# Altium schematic sheet Sheet1.SchDoc
size A3
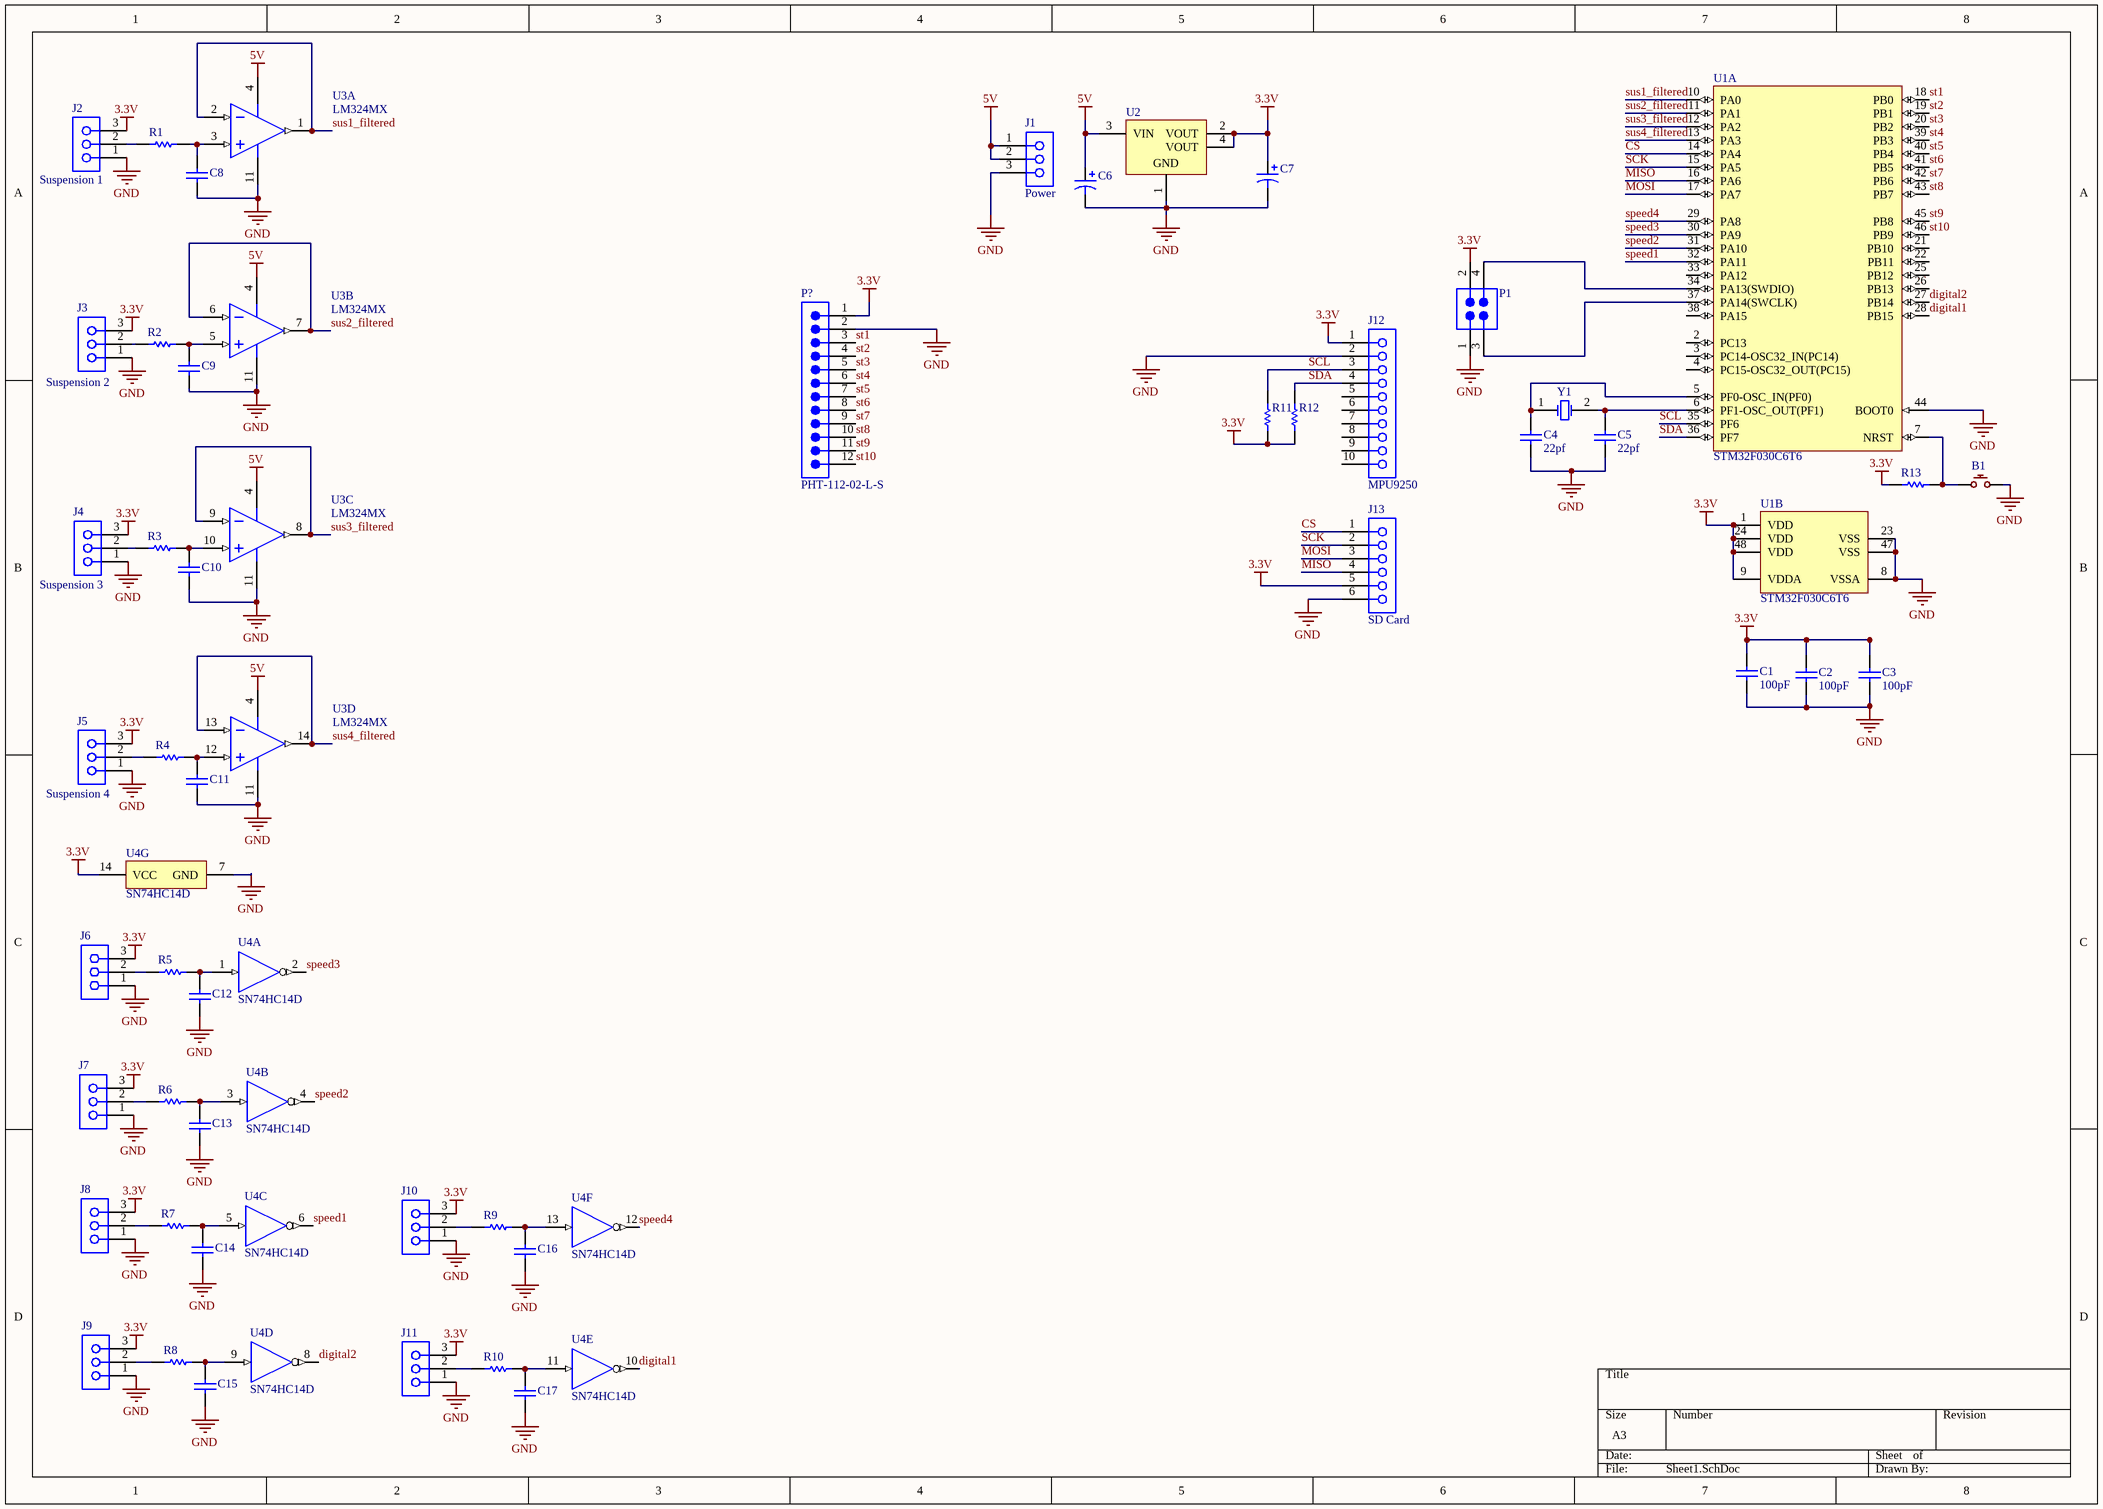
[diagram p0: Sheet1.SchDoc]

## Parts
B1  Reset Button  [SMD Mini Push Button Switch 4 Pin]  (value not drawn)
C1  value 100pF  [1206]  (hidden comment: C1206)
C2  value 100pF  [1206]  (hidden comment: C1206)
C3  value 100pF  [1206]  (hidden comment: C1206)
C4  value 22pf  [1206]  (hidden comment: C1206)
C5  value 22pf  [1206]  (hidden comment: C1206)
C6  EKA00AA210L00  [CAPPR2-5X11]  (value not drawn)
C7  EKA00DD222S00  [CAPPR5-10X16]  (value not drawn)
C8  C1206  [1206]  (value not drawn)
C9  C1206  [1206]  (value not drawn)
C10  C1206  [1206]  (value not drawn)
C11  C1206  [1206]  (value not drawn)
C12  C1206  [1206]  (value not drawn)
C13  C1206  [1206]  (value not drawn)
C14  C1206  [1206]  (value not drawn)
C15  C1206  [1206]  (value not drawn)
C16  C1206  [1206]  (value not drawn)
C17  C1206  [1206]  (value not drawn)
J1  Power  [SMTC-BCS-103-X-S-TE]
J2  Suspension 1  [SMTC-BCS-103-X-S-TE]
J3  Suspension 2  [SMTC-BCS-103-X-S-TE]
J4  Suspension 3  [SMTC-BCS-103-X-S-TE]
J5  Suspension 4  [SMTC-BCS-103-X-S-TE]
J6  BCS-103-L-S-TE  [SMTC-BCS-103-X-S-TE]  (value not drawn)
J7  BCS-103-L-S-TE  [SMTC-BCS-103-X-S-TE]  (value not drawn)
J8  BCS-103-L-S-TE  [SMTC-BCS-103-X-S-TE]  (value not drawn)
J9  BCS-103-L-S-TE  [SMTC-BCS-103-X-S-TE]  (value not drawn)
J10  BCS-103-L-S-TE  [SMTC-BCS-103-X-S-TE]  (value not drawn)
J11  BCS-103-L-S-TE  [SMTC-BCS-103-X-S-TE]  (value not drawn)
J12  MPU9250  [SMTC-SSW-110-03-X-S]
J13  SD Card  [SMTC-SSW-106-02-X-S]
P1  HW-02-12-T-D-750-100  [SMTC-HW-02-12-X-D-750-100]  (value not drawn)
P?  PHT-112-02-L-S  [SMTC-PHT-112-02-X-S]
R1  ERJ8GE  [8-1206]  (value not drawn)
R2  ERJ8GE  [8-1206]  (value not drawn)
R3  ERJ8GE  [8-1206]  (value not drawn)
R4  ERJ8GE  [8-1206]  (value not drawn)
R5  ERJ8GE  [8-1206]  (value not drawn)
R6  ERJ8GE  [8-1206]  (value not drawn)
R7  ERJ8GE  [8-1206]  (value not drawn)
R8  ERJ8GE  [8-1206]  (value not drawn)
R9  ERJ8GE  [8-1206]  (value not drawn)
R10  ERJ8GE  [8-1206]  (value not drawn)
R11  ERJ8GE  [8-1206]  (value not drawn)
R12  ERJ8GE  [8-1206]  (value not drawn)
R13  ERJ8GE  [8-1206]  (value not drawn)
U1  STM32F030C6T6  [STM-LQFP48_N]  (parts A,B of 2)
U2  LD1117AS33TR  [SOT-223_N]  (value not drawn)
U3  LM324MX  [M14A_N]  (parts A,B,C,D of 4)
U4  SN74HC14D  [D0014A_N]  (parts A,B,C,D,E,F,G of 7)
Y1  ECS-10-13-1  [HC-49U]  (value not drawn)

## Nets
3.3V: C1.2 C2.2 C3.2 C7.1 J2.3 J3.3 J4.3 J5.3 J6.3 J7.3 J8.3 J9.3 J10.3 J11.3 J12.1 J13.5 P1.2 P?.1 R11.1 R12.1 R13.1 U1.1(VDD) U1.9(VDDA) U1.24(VDD) U1.48(VDD) U2.2(VOUT) U2.4(VOUT) U4.14(VCC)
5V: C6.1 J1.1 J1.2 U2.3(VIN) U3.4(V+)
GND: B1.2 C1.1 C2.1 C3.1 C4.1 C5.1 C6.2 C7.2 C8.1 C9.1 C10.1 C11.1 C12.1 C13.1 C14.1 C15.1 C16.1 C17.1 J1.3 J2.1 J3.1 J4.1 J5.1 J6.1 J7.1 J8.1 J9.1 J10.1 J11.1 J12.2 J13.6 P1.1 P?.2 U1.8(VSSA) U1.23(VSS) U1.44(BOOT0) U1.47(VSS) U2.1(GND) U3.11(GND) U4.7(GND)
CS: J13.1 U1.14(PA4)
digital1: U1.28(PB15) U4.10(~{5Y})
digital2: U1.27(PB14) U4.8(~{4Y})
MISO: J13.4 U1.16(PA6)
MOSI: J13.3 U1.17(PA7)
SCK: J13.2 U1.15(PA5)
SCL: J12.3 R11.2 U1.35(PF6)
SDA: J12.4 R12.2 U1.36(PF7)
speed1: U1.32(PA11) U4.6(~{3Y})
speed2: U1.31(PA10) U4.4(~{2Y})
speed3: U1.30(PA9) U4.2(~{1Y})
speed4: U1.29(PA8) U4.12(~{6Y})
st1: P?.3 U1.18(PB0)
st2: P?.4 U1.19(PB1)
st3: P?.5 U1.20(PB2)
st4: P?.6 U1.39(PB3)
st5: P?.7 U1.40(PB4)
st6: P?.8 U1.41(PB5)
st7: P?.9 U1.42(PB6)
st8: P?.10 U1.43(PB7)
st9: P?.11 U1.45(PB8)
st10: P?.12 U1.46(PB9)
sus1_filtered: U1.10(PA0) U3.1(OUT1) U3.2(IN1-)
sus2_filtered: U1.11(PA1) U3.6(IN2-) U3.7(OUT2)
sus3_filtered: U1.12(PA2) U3.8(OUT3) U3.9(IN3-)
sus4_filtered: U1.13(PA3) U3.13(IN4-) U3.14(OUT4)
NetB1_1: B1.1 R13.2 U1.7(NRST)
NetC4_2: C4.2 U1.5(PF0-OSC_IN(PF0)) Y1.1(OSC1)
NetC5_2: C5.2 U1.6(PF1-OSC_OUT(PF1)) Y1.2(OSC2)
NetC8_2: C8.2 R1.2 U3.3(IN1+)
NetC9_2: C9.2 R2.2 U3.5(IN2+)
NetC10_2: C10.2 R3.2 U3.10(IN3+)
NetC11_2: C11.2 R4.2 U3.12(IN4+)
NetC12_2: C12.2 R5.2 U4.1(1A)
NetC13_2: C13.2 R6.2 U4.3(2A)
NetC14_2: C14.2 R7.2 U4.5(3A)
NetC15_2: C15.2 R8.2 U4.9(4A)
NetC16_2: C16.2 R9.2 U4.13(6A)
NetC17_2: C17.2 R10.2 U4.11(5A)
NetJ2_2: J2.2 R1.1
NetJ3_2: J3.2 R2.1
NetJ4_2: J4.2 R3.1
NetJ5_2: J5.2 R4.1
NetJ6_2: J6.2 R5.1
NetJ7_2: J7.2 R6.1
NetJ8_2: J8.2 R7.1
NetJ9_2: J9.2 R8.1
NetJ10_2: J10.2 R9.1
NetJ11_2: J11.2 R10.1
NetP1_3: P1.3 U1.37(PA14(SWCLK))
NetP1_4: P1.4 U1.34(PA13(SWDIO))

Not connected (* = marked no-connect by the designer): J12 5 6 7 8 9 10; U1 2(PC13) 3(PC14-OSC32_IN(PC14)) 4(PC15-OSC32_OUT(PC15)) 21(PB10) 22(PB11) 25(PB12) 26(PB13) 33(PA12) 38(PA15)

## Library data of the parts
B1 = SMD Mini Push Button Switch 4 Pin
C1-C5 = C1206: Ceramic Chip Capacitor - Standard; Published: 17-Jul-2002; LatestRevisionDate: 19-Mar-2004; LatestRevisionNote: Silkscreen size reduced.; DatasheetDocument: Mar-2001; PackageDocument: Mar-2001; PackageReference: 1206; Publisher: Altium Limited; Code_JEITA: 1206; Code_IPC: 3216 [1206]; ComponentLink1Description: Manufacturer Link; ComponentLink1URL: http://www.kemet.com/; ComponentLink2Description: Datasheet; ComponentLink2URL: http://www.kemet.com/kemet/web/homepage/kechome.nsf/vapubfilesname/F3102TA.pdf/$file/F3102TA.pdf
C6 = EKA00AA210L00: Aluminum Electrolytic Capacitor, Radial Style with Long Leads: 10uF, 100V; Note: Refer to Manufacturer's Data Sheets for other lead formations; DrillSize: Nominal, Rounded To The Nearest 0.1mm; Published: 19-Mar-2004; DatasheetDocument: 20-Feb-2001; PackageReference: CAPPR2-5X11; Publisher: Altium Limited; ComponentLink1Description: Manufacturer Link; ComponentLink1URL: http://www.vishay.com/; ComponentLink2Description: Datasheet; ComponentLink2URL: http://www.vishay.com/docs/25014/eka.pdf; Value: 10uF
C7 = EKA00DD222S00: Aluminum Electrolytic Capacitor, Radial Style with Long Leads: 22uF, 200V; Note: Refer to Manufacturer's Data Sheets for other lead formations; DrillSize: Nominal, Rounded To The Nearest 0.1mm; Published: 19-Mar-2004; DatasheetDocument: 20-Feb-2001; PackageReference: CAPPR5-10X16; Publisher: Altium Limited; ComponentLink1Description: Manufacturer Link; ComponentLink1URL: http://www.vishay.com/; ComponentLink2Description: Datasheet; ComponentLink2URL: http://www.vishay.com/docs/25014/eka.pdf; Value: 22uF
C8-C17 = C1206: Ceramic Chip Capacitor - Standard; Value: 100pF; Published: 17-Jul-2002; LatestRevisionDate: 19-Mar-2004; LatestRevisionNote: Silkscreen size reduced.; DatasheetDocument: Mar-2001; PackageDocument: Mar-2001; PackageReference: 1206; Publisher: Altium Limited; Code_JEITA: 1206; Code_IPC: 3216 [1206]; ComponentLink1Description: Manufacturer Link; ComponentLink1URL: http://www.kemet.com/; ComponentLink2Description: Datasheet; ComponentLink2URL: http://www.kemet.com/kemet/web/homepage/kechome.nsf/vapubfilesname/F3102TA.pdf/$file/F3102TA.pdf
J1 = BCS-103-F-S-TE: Tiger Claw(TM) Pass-Through Socket, Vertical, -55 to 125 degC, 2.54 mm Pitch, 3-Pin, Female, RoHS; Manufacturer: Samtec; Pitch: 2.54 mm; DatasheetVersion: F-214; PackageVersion: BV, 9/1991; PackageReference: BCS-103-X-S-TE; PackageDescription: Box Connector Socket Strip; Orientation: Vertical; RoHS: True; Temperature Range: -55 to 125 degC; Mounting Technology: Through-hole; PartNumber: BCS-103-F-S-TE; ComponentLink1Description: Manufacturer URL; ComponentLink1URL: http://www.samtec.com; ComponentLink2Description: Datasheet; ComponentLink2URL: http://www.samtec.com/documents/webfiles/pdf/BCS.PDF; ComponentLink3Description: Package Specification; ComponentLink3URL: http://www.samtec.com/documents/webfiles/cpdf/BCS-1XX-XXX-X-XX-XXX-MKT.pdf
J2-J11 = BCS-103-L-S-TE: Tiger Claw(TM) Pass-Through Socket, Vertical, -55 to 125 degC, 2.54 mm Pitch, 3-Pin, Female, RoHS; Manufacturer: Samtec; Pitch: 2.54 mm; DatasheetVersion: F-214; PackageVersion: BV, 9/1991; PackageReference: BCS-103-X-S-TE; PackageDescription: Box Connector Socket Strip; Supplier 1: Digi-Key; Supplier Part Number 1: SAM1011-03-ND; Supplier 2: Newark; Supplier Part Number 2: 11P3213; Orientation: Vertical; RoHS: True; Temperature Range: -55 to 125 degC; Mounting Technology: Through-hole; PartNumber: BCS-103-L-S-TE; ComponentLink1Description: Manufacturer URL; ComponentLink1URL: http://www.samtec.com; ComponentLink2Description: Datasheet; ComponentLink2URL: http://www.samtec.com/documents/webfiles/pdf/BCS.PDF; ComponentLink3Description: Package Specification; ComponentLink3URL: http://www.samtec.com/documents/webfiles/cpdf/BCS-1XX-XXX-X-XX-XXX-MKT.pdf
J12 = SSW-110-03-T-S: SQ Post Socket, Through-hole, Vertical, -55 to 105 degC, 2.54 mm Pitch, 10-Pin, Female, RoHS; Manufacturer: Samtec; Pitch: 2.54 mm; DatasheetVersion: F-214; PackageVersion: CA, 6/1987; PackageReference: SSW-110-03-X-S; PackageDescription: Assembly, Socket Strip .016 X .031 Tail; Orientation: Vertical; RoHS: True; Temperature Range: -55 to 105 degC; Mounting Technology: Through-hole; PartNumber: SSW-110-03-T-S; ComponentLink1Description: Manufacturer URL; ComponentLink1URL: http://www.samtec.com; ComponentLink2Description: Datasheet; ComponentLink2URL: http://www.samtec.com/documents/webfiles/pdf/SSW_TH.PDF; ComponentLink3Description: Package Specification; ComponentLink3URL: http://www.samtec.com/documents/webfiles/cpdf/SSW-1XX-XX-XXX-X-XX-XXX-XX-MKT.pdf
J13 = SSW-106-02-T-S: SQ Post Socket, Through-hole, Vertical, -55 to 105 degC, 2.54mm Pitch, 6-Pin, Female, RoHS; Manufacturer: Samtec; DatasheetVersion: F-214; PackageVersion: CA, 6/1987; PackageReference: SSW-106-02-X-S; PackageDescription: Assembly, Socket Strip .016 X .031 Tail; Supplier 1: Digi-Key; Supplier Part Number 1: SAM1222-06-ND; Supplier 2: Newark; Supplier Part Number 2: 11P9419; Orientation: Vertical; Pitch: 2.54 mm; RoHS: True; Temperature Range: -55 to 105 degC; Mounting Technology: Through-hole; PartNumber: SSW-106-02-T-S; ComponentLink1Description: Manufacturer URL; ComponentLink1URL: http://www.samtec.com; ComponentLink2Description: Datasheet; ComponentLink2URL: http://www.samtec.com/documents/webfiles/pdf/SSW_TH.PDF; ComponentLink3Description: Package Specification; ComponentLink3URL: http://www.samtec.com/documents/webfiles/cpdf/SSW-1XX-XX-XXX-X-XX-XXX-XX-MKT.pdf
P1 = HW-02-12-T-D-750-100: Flexible .025" SQ Board Stacker, Through-hole, Vertical, -55 to 105 degC, 2.54 mm Pitch, 4-Pin, Male, RoHS; Manufacturer: Samtec; Pitch: 2.54 mm; DatasheetVersion: F-214; PackageVersion: Y, 8/1991; PackageReference: HW-02-12-X-D-750-100; PackageDescription: .100[2.54] High Temp Terminal Body (Board Stacking); Orientation: Vertical; RoHS: True; Temperature Range: -55 to 105 degC; Mounting Technology: Through-hole; PartNumber: HW-02-12-T-D-750-100; ComponentLink1Description: Datasheet; ComponentLink1URL: http://www.samtec.com/documents/webfiles/pdf/HW_TH.PDF; ComponentLink2Description: Package Specification; ComponentLink2URL: http://www.samtec.com/documents/webfiles/cpdf/HW-XX-XX-XX-X-XXX-XXX-XX-XXX-MKT.pdf
P? = PHT-112-02-L-S: Press Fit Header, Through-hole, Vertical, -55 to 125 degC, 2.54 mm Pitch, 12-Pin, Male, RoHS; Manufacturer: Samtec; Pitch: 2.54 mm; DatasheetVersion: F-214; PackageVersion: J, 9/2009; PackageReference: PHT-112-02-X-S; PackageDescription: .100 Press Fit Socket Assembly; Orientation: Vertical; RoHS: True; Temperature Range: -55 to 125 degC; Mounting Technology: Through-hole; PartNumber: PHT-112-02-L-S; ComponentLink1Description: Manufacturer URL; ComponentLink1URL: http://www.samtec.com; ComponentLink2Description: Datasheet; ComponentLink2URL: http://www.samtec.com/documents/webfiles/pdf/pht.pdf; ComponentLink3Description: Package Specification; ComponentLink3URL: http://www.samtec.com/documents/webfiles/cpdf/PHT-1XX-XX-X-X-XXX-MKT.pdf
R1-R13 = ERJ8GE: Thick Film Chip Resistor, 1 Ohm to 10M Ohm Range, 5% Tolerance, 1206 Size, 0.25 W; Note: If flow soldering, adjust pad width of PCB Footprint to 0.7 - 0.8 times the width of the resistor.; Published: 17-Dec-2003; LatestRevisionDate: 19-Mar-2004; LatestRevisionNote: Silkscreen size reduced.; PackageDocument: Mar-2003; PackageReference: 8-1206; Publisher: Altium Limited; Code_IPC: 3216 [1206]; ComponentLink1Description: Manufacturer Link; ComponentLink1URL: http://www.panasonic.com/industrial/components/resistive_products.htm; ComponentLink2Description: Datasheet; ComponentLink2URL: http://www.panasonic.com/industrial/components/pdf/AOA0000CE1.pdf
U1 = STM32F030C6T6: ARM Cortex-M0 32-bit MCU, 32 KB Flash, 4 KB Internal RAM, 39 I/Os, 48-pin LQFP, -40 to 85 degC, Tray; FLASH Size (Prog) (kB): 32; I/Os (High Current): 39; Internal RAM Size (kB): 4; Operating Frequency(F) (Processor speed) (MHz): 48; Supply Voltage(Vcc) min (V): 2.4; DatasheetVersion: Rev. 1; PackageVersion: Rev. 6, 06/2013; PackageReference: LQFP48; PackageDescription: 48-Pin Low Profile Quad Flat Package, 7 x 7 mm Body, 0.5 mm Pitch; Supplier 1: Digi-Key; Supplier Part Number 1: 497-14042-ND; Supplier 2: Newark; Supplier Part Number 2: 06X3646; Supplier 3: Mouser; Supplier Part Number 3: 511-STM32F030C6T6; Core: ARM Cortex-M0; Packing: Tray; Mounting Technology: Surface Mount; PartNumber: STM32F030C6T6; ComponentLink1Description: Manufacturer URL; ComponentLink1URL: http://www.st.com/web/en/home.html; ComponentLink2Description: Datasheet; ComponentLink2URL: http://www.st.com/st-web-ui/static/active/en/resource/technical/document/datasheet/DM00088500.pdf; ComponentLink3Description: Package Specification; ComponentLink3URL: http://www.st.com/st-web-ui/static/active/en/resource/technical/document/datasheet/DM00058181.pdf
U2 = LD1117AS33TR: 1A, Low Drop Positive Voltage Regulator, 3.3V, 4-Pin SOT-223, Tape and Reel; DatasheetVersion: Dec-2011; PackageVersion: 2010; PackageReference: SOT-223; PackageDescription: 4-Pin SOT-223 Package, 6.5 x 3.5 mm Body, 2.3 mm Pitch, 7 mm Lead Span; PartNumber: LD1117AS33TR; ComponentLink1Description: Manufacturer URL; ComponentLink1URL: http://www.st.com; ComponentLink2Description: Datasheet; ComponentLink2URL: http://www.st.com/internet/com/TECHNICAL_RESOURCES/TECHNICAL_LITERATURE/DATASHEET/CD00002116.pdf
U3 = LM324MX: Low Power Quad Operational Amplifier, 14-pin Narrow SOIC; Manufacturer: National Semiconductor; PackageTopMarking: NSUZXYTTE#*LM324M; PowerWise: N; CompType: Amplifiers; High-Reliability: Y; DatasheetVersion: Aug-2000; PackageVersion: revJ, Jan-1996; PackageReference: M14A; PackageDescription: Molded Package S.O., .150in Wide, 14 Lead; PartNumber: LM324MX; RoHS: N; PinCount: 14; Code_JEDEC: MS-012AB; Code_IPC: SOIC127P600-14; ComponentLink1Description: Manufacturer URL; ComponentLink1URL: http://www.national.com/; ComponentLink2Description: LM324 Datasheet; ComponentLink2URL: http://www.national.com/ds/LM/LM324.pdf; ComponentLink3Description: LM324 Web Page; ComponentLink3URL: http://www.national.com/pf/LM/LM324.html; ComponentLink4Description: M14A Package Page; ComponentLink4URL: http://www.national.com/packaging/folders/m14a.html
U4 = SN74HC14D: Hex Schmitt-Trigger Inverters, D0014A, TUBE; Manufacturer: Texas Instruments; VCC(Min)(V): 2; VCC(Max)(V): 6; Output Type: CMOS; ICC @ Nom Voltage(Max)(mA): 0.02; F @ Nom Voltage(Max)(Mhz): 20; Rating: Catalog; Technology Family: HC; Voltage(Nom)(V): 5; Schmitt Trigger: Yes; Output Drive (IOL/IOH)(Max)(mA): -4/4; tpd @ Nom Voltage(Max)(ns): 31; DatasheetVersion: SCLS085G; PackageReference: D0014A; Generic Part Number: SN74HC14; Input Type: CMOS; Bits(#): 6; Operating Temperature Range(C): -40 to 85; PartNumber: SN74HC14D; ComponentLink1Description: Manufacturer URL; ComponentLink1URL: http://www.ti.com/; ComponentLink2Description: Datasheet; ComponentLink2URL: http://www.ti.com/lit/ds/symlink/sn74hc14.pdf; ComponentLink3Description: Package Specification; ComponentLink3URL: http://www.ti.com/lit/ml/mpds177g/mpds177g.pdf
Y1 = ECS-10-13-1: Crystal Oscillator; Published: 17-Jul-2002; DatasheetDocument: 18-Apr-2000; PackageReference: HC-49U; Publisher: Altium Limited; ComponentLink1Description: Manufacturer Link; ComponentLink1URL: http://www.ecsxtal.com/; ComponentLink2Description: Datasheet; ComponentLink2URL: http://www.ecsxtal.com/pdf2/HC49U.PDF